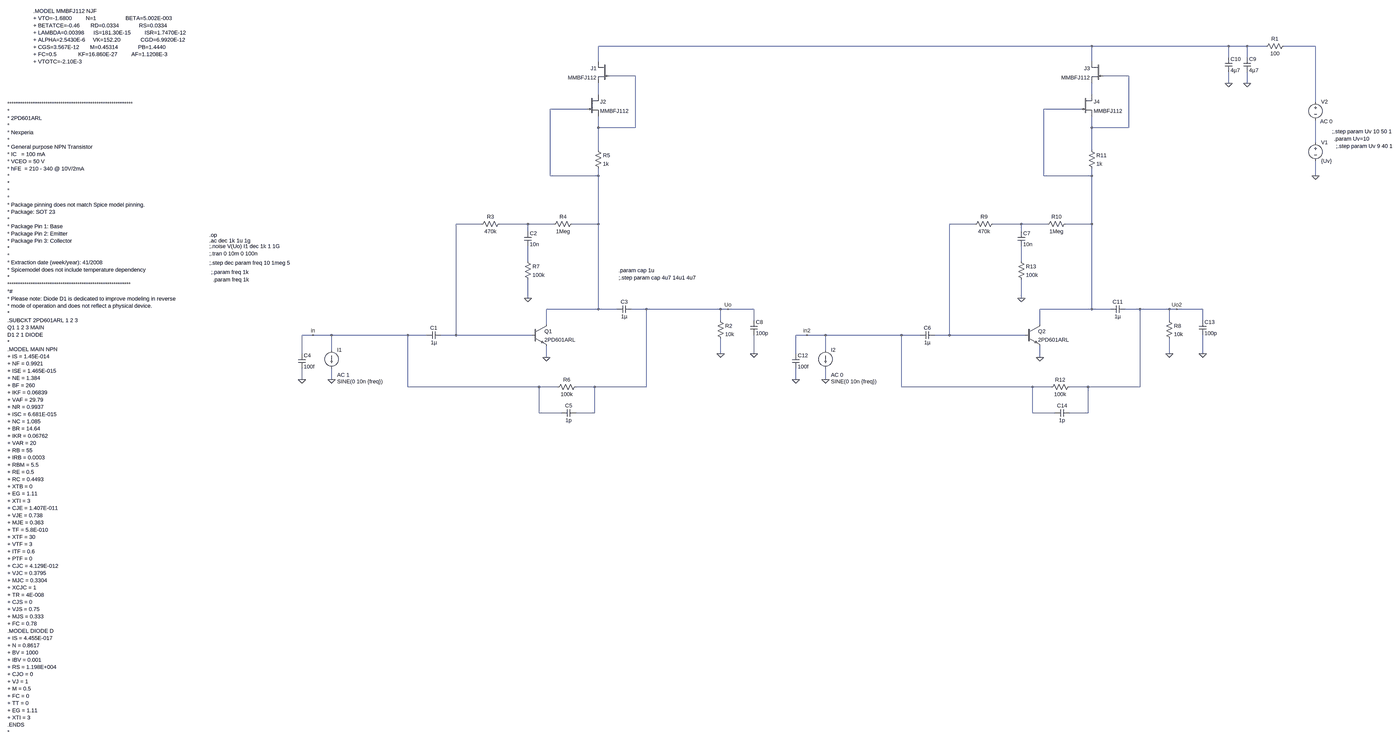
[diagram p0: schematic v2.0.crosstalk.asc, whole sheet]
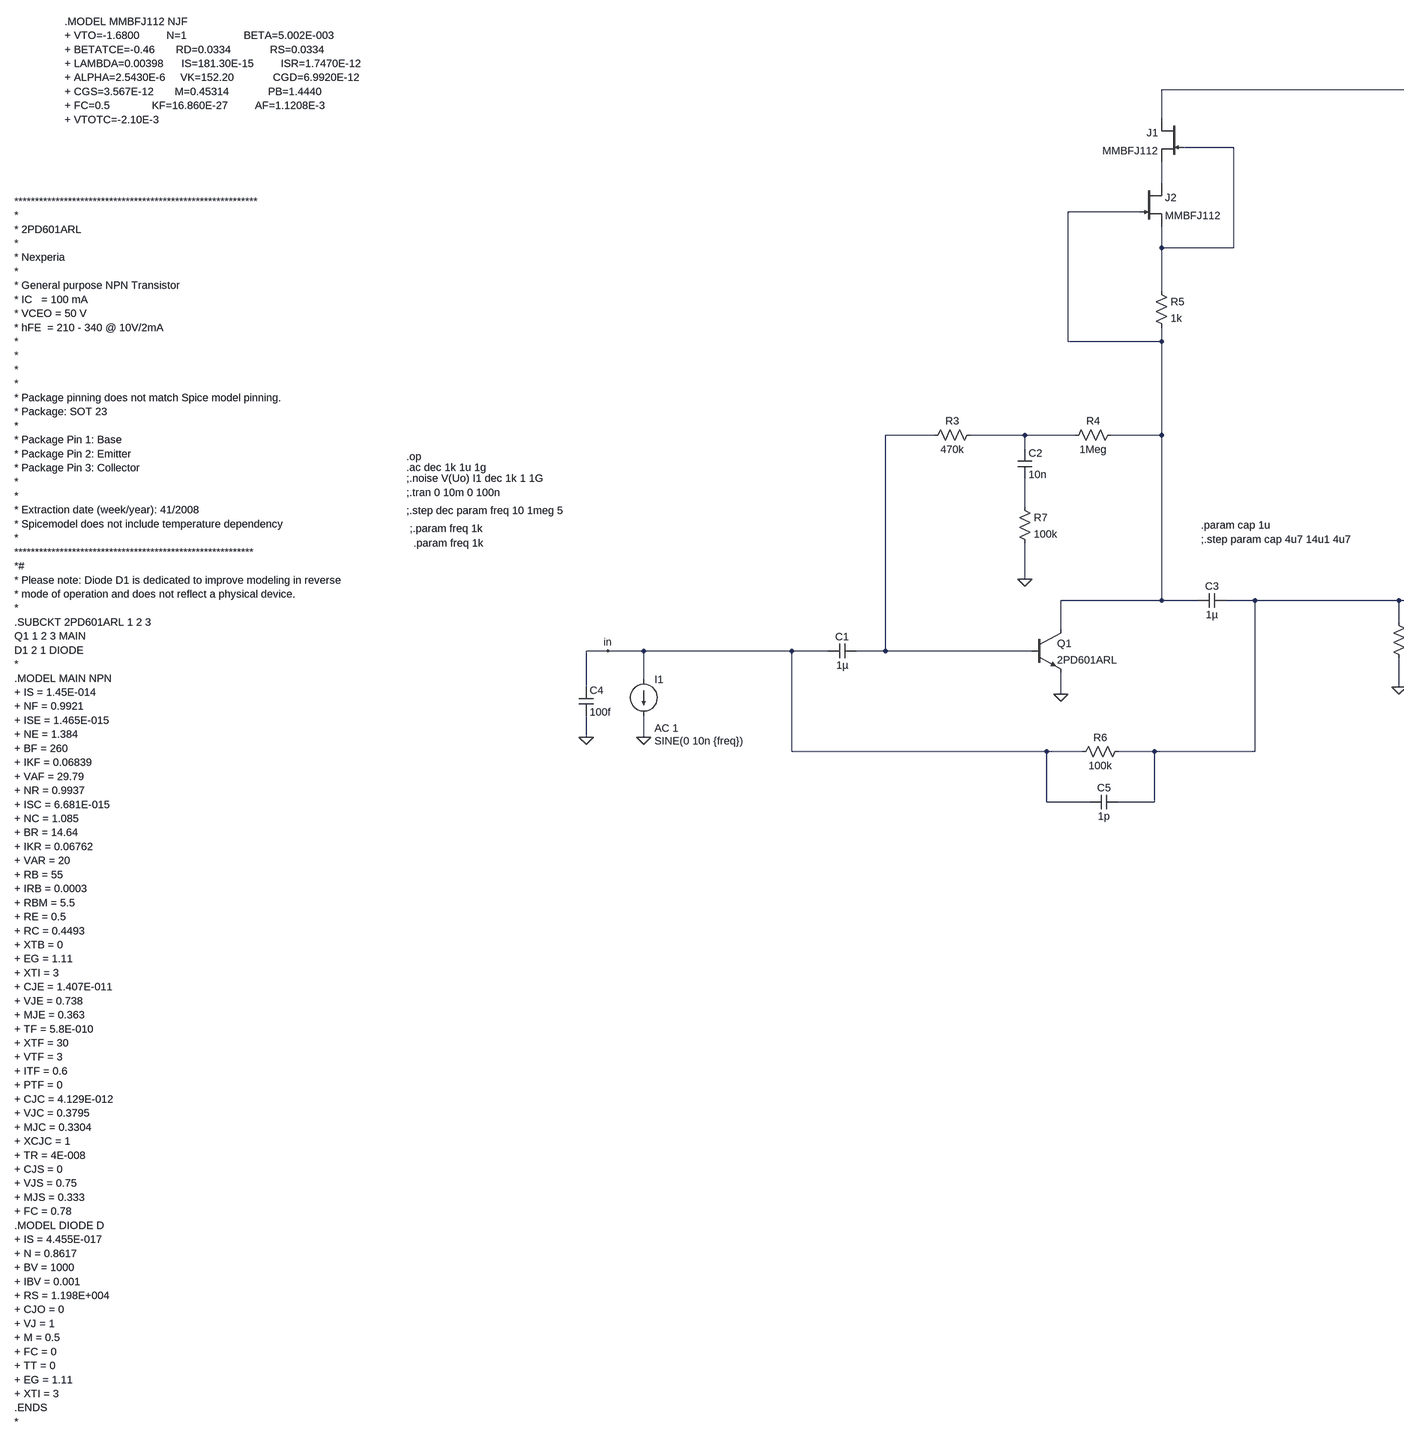
[diagram p1: schematic v2.0.crosstalk.asc, part, row 1 of 1, column 1 of 2]
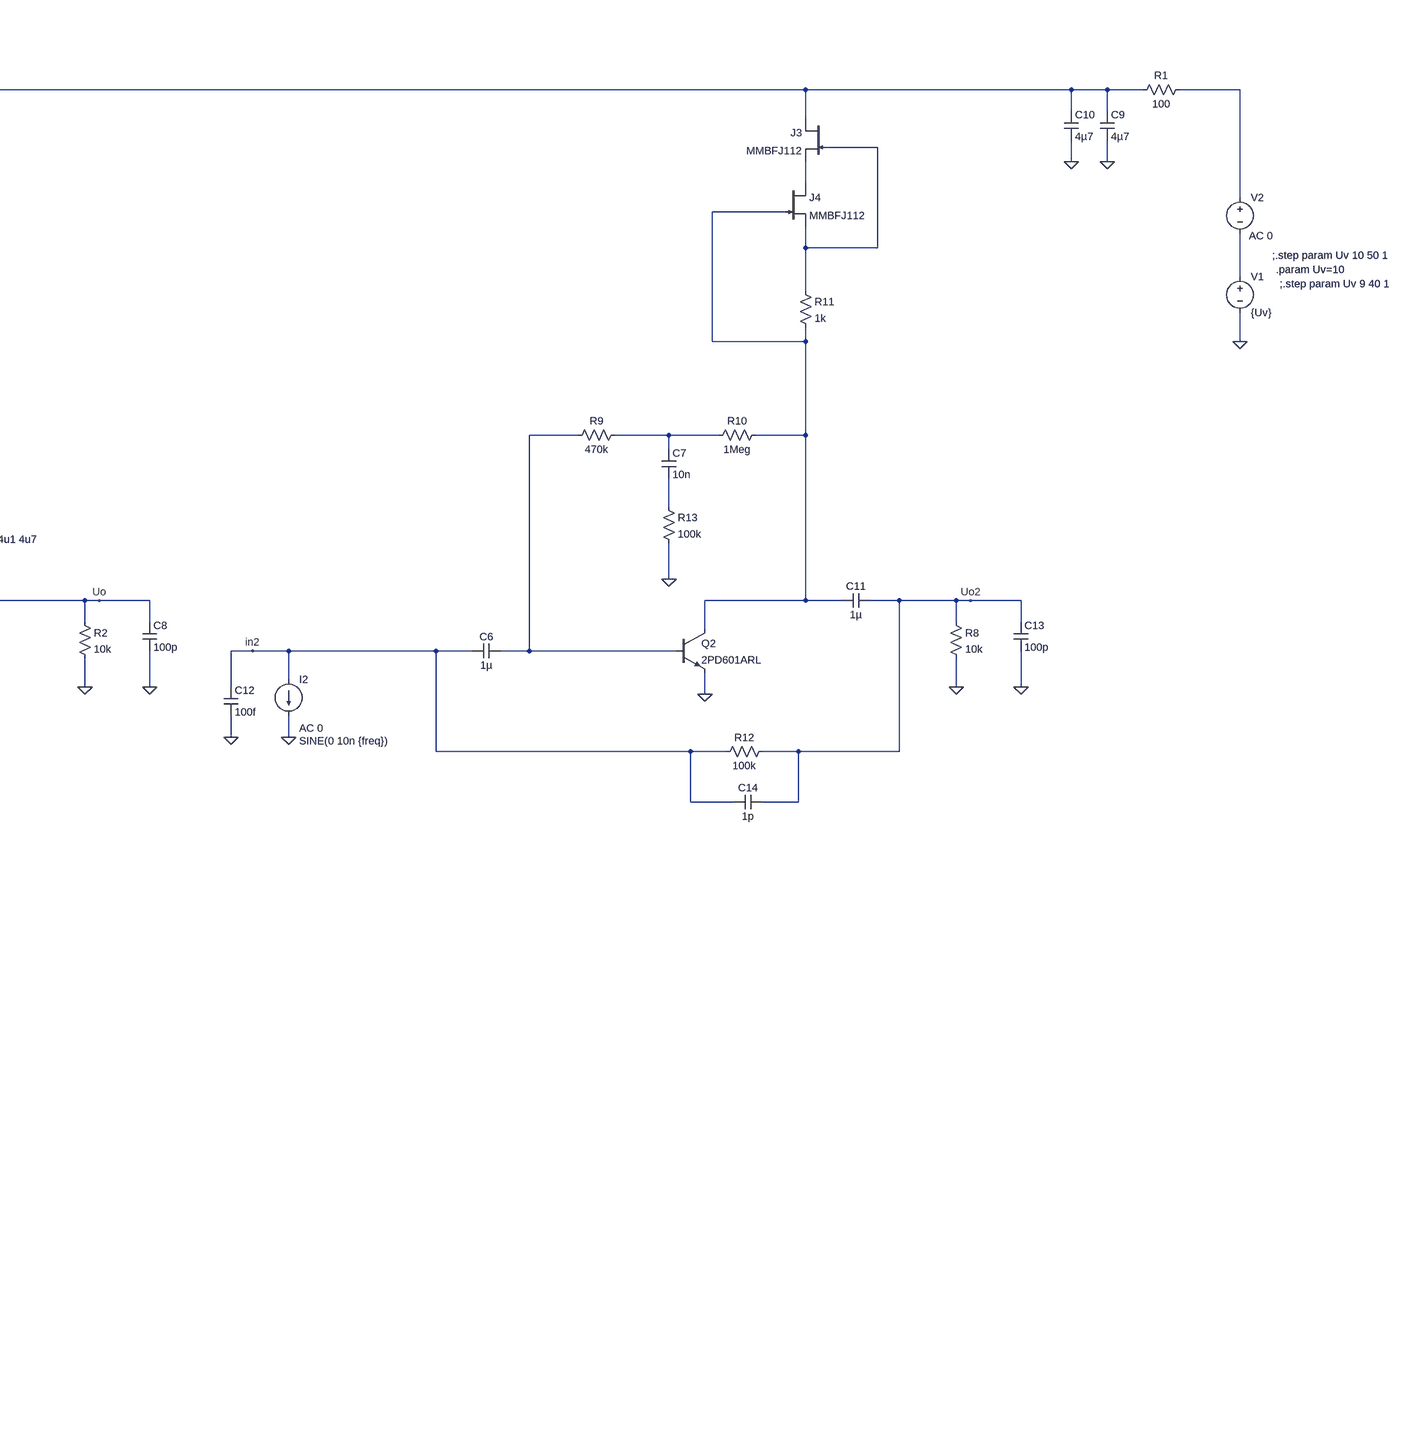
[diagram p2: schematic v2.0.crosstalk.asc, part, row 1 of 1, column 2 of 2]
v2.0.crosstalk.asc, the LTspice schematic file:
Version 4
SHEET 1 4916 2076
WIRE 3296 -816 624 -816
WIRE 4080 -816 3296 -816
WIRE 4160 -816 4080 -816
WIRE 4240 -816 4160 -816
WIRE 4560 -816 4320 -816
WIRE 4080 -768 4080 -816
WIRE 4160 -768 4160 -816
WIRE 624 -752 624 -816
WIRE 3296 -752 3296 -816
WIRE 784 -688 672 -688
WIRE 3456 -688 3344 -688
WIRE 4080 -656 4080 -704
WIRE 4160 -656 4160 -704
WIRE 624 -608 624 -656
WIRE 3296 -608 3296 -656
WIRE 4560 -576 4560 -816
WIRE 576 -544 416 -544
WIRE 3248 -544 3088 -544
WIRE 624 -464 624 -512
WIRE 784 -464 784 -688
WIRE 784 -464 624 -464
WIRE 3296 -464 3296 -512
WIRE 3456 -464 3456 -688
WIRE 3456 -464 3296 -464
WIRE 4560 -400 4560 -496
WIRE 624 -368 624 -464
WIRE 3296 -368 3296 -464
WIRE 416 -256 416 -544
WIRE 624 -256 624 -288
WIRE 624 -256 416 -256
WIRE 3088 -256 3088 -544
WIRE 3296 -256 3296 -288
WIRE 3296 -256 3088 -256
WIRE 4560 -256 4560 -320
WIRE -16 -48 -160 -48
WIRE 320 -48 64 -48
WIRE 432 -48 320 -48
WIRE 624 -48 624 -256
WIRE 624 -48 512 -48
WIRE 2656 -48 2512 -48
WIRE 2992 -48 2736 -48
WIRE 3104 -48 2992 -48
WIRE 3296 -48 3296 -256
WIRE 3296 -48 3184 -48
WIRE 320 -16 320 -48
WIRE 2992 -16 2992 -48
WIRE 320 112 320 48
WIRE 2992 112 2992 48
WIRE 320 272 320 192
WIRE 2992 272 2992 192
WIRE 624 320 624 -48
WIRE 624 320 400 320
WIRE 704 320 624 320
WIRE 832 320 768 320
WIRE 1152 320 832 320
WIRE 1184 320 1152 320
WIRE 1296 320 1184 320
WIRE 3296 320 3296 -48
WIRE 3296 320 3072 320
WIRE 3376 320 3296 320
WIRE 3504 320 3440 320
WIRE 3824 320 3504 320
WIRE 3856 320 3824 320
WIRE 3968 320 3856 320
WIRE 1152 368 1152 320
WIRE 1296 368 1296 320
WIRE 3824 368 3824 320
WIRE 3968 368 3968 320
WIRE 400 384 400 320
WIRE 3072 384 3072 320
WIRE -1104 432 -1152 432
WIRE -1024 432 -1104 432
WIRE -368 432 -1024 432
WIRE -288 432 -368 432
WIRE -160 432 -160 -48
WIRE -160 432 -224 432
WIRE 336 432 -160 432
WIRE 1568 432 1520 432
WIRE 1648 432 1568 432
WIRE 2304 432 1648 432
WIRE 2384 432 2304 432
WIRE 2512 432 2512 -48
WIRE 2512 432 2448 432
WIRE 3008 432 2512 432
WIRE -1024 496 -1024 432
WIRE 1648 496 1648 432
WIRE -1152 512 -1152 432
WIRE 1152 512 1152 448
WIRE 1296 512 1296 432
WIRE 1520 512 1520 432
WIRE 3824 512 3824 448
WIRE 3968 512 3968 432
WIRE 400 528 400 480
WIRE 3072 528 3072 480
WIRE -1152 624 -1152 576
WIRE -1024 624 -1024 576
WIRE 1520 624 1520 576
WIRE 1648 624 1648 576
WIRE -368 656 -368 432
WIRE 368 656 -368 656
WIRE 448 656 368 656
WIRE 608 656 528 656
WIRE 832 656 832 320
WIRE 832 656 608 656
WIRE 2304 656 2304 432
WIRE 3040 656 2304 656
WIRE 3120 656 3040 656
WIRE 3280 656 3200 656
WIRE 3504 656 3504 320
WIRE 3504 656 3280 656
WIRE 368 768 368 656
WIRE 464 768 368 768
WIRE 608 768 608 656
WIRE 608 768 528 768
WIRE 3040 768 3040 656
WIRE 3136 768 3040 768
WIRE 3280 768 3280 656
WIRE 3280 768 3200 768
FLAG 400 528 0
FLAG 1152 512 0
FLAG 1184 320 Uo
FLAG 320 272 0
FLAG 4560 -256 0
FLAG -1024 624 0
FLAG -1152 624 0
FLAG 1296 512 0
FLAG 4080 -656 0
FLAG 4160 -656 0
FLAG -1104 432 in
FLAG 3072 528 0
FLAG 3824 512 0
FLAG 3856 320 Uo2
FLAG 2992 272 0
FLAG 1648 624 0
FLAG 1520 624 0
FLAG 3968 512 0
FLAG 1568 432 in2
DATAFLAG 224 432 ""
DATAFLAG 480 320 ""
DATAFLAG 912 320 ""
DATAFLAG 704 -816 "$-V(N003)"
DATAFLAG 480 -544 "$-V(N003)"
DATAFLAG 2896 432 ""
DATAFLAG 3152 320 ""
DATAFLAG 3584 320 ""
DATAFLAG 3376 -816 "$-V(N003)"
DATAFLAG 3152 -544 "$-V(N003)"
SYMBOL res 1136 352 R0
SYMATTR InstName R2
SYMATTR Value 10k
SYMBOL cap -224 416 R90
WINDOW 0 0 32 VBottom 2
WINDOW 3 32 32 VTop 2
SYMATTR InstName C1
SYMATTR Value 1µ
SYMBOL res 80 -64 R90
WINDOW 0 0 56 VBottom 2
WINDOW 3 32 56 VTop 2
SYMATTR InstName R3
SYMATTR Value 470k
SYMBOL res 528 -64 R90
WINDOW 0 0 56 VBottom 2
WINDOW 3 32 56 VTop 2
SYMATTR InstName R4
SYMATTR Value 1Meg
SYMBOL cap 304 -16 R0
SYMATTR InstName C2
SYMATTR Value 10n
SYMBOL cap 768 304 R90
WINDOW 0 0 32 VBottom 2
WINDOW 3 32 32 VTop 2
SYMATTR InstName C3
SYMATTR Value 1µ
SYMBOL njf 672 -752 M0
SYMATTR InstName J1
SYMATTR Value MMBFJ112
SYMBOL res 608 -384 R0
SYMATTR InstName R5
SYMATTR Value 1k
SYMBOL voltage 4560 -416 R0
WINDOW 123 0 0 Left 0
WINDOW 39 0 0 Left 0
SYMATTR InstName V1
SYMATTR Value {Uv}
SYMBOL current -1024 496 R0
WINDOW 3 24 136 Left 2
WINDOW 123 24 108 Left 2
WINDOW 39 0 0 Left 0
SYMATTR Value SINE(0 10n {freq})
SYMATTR Value2 AC 1
SYMATTR InstName I1
SYMBOL cap -1168 512 R0
SYMATTR InstName C4
SYMATTR Value 100f
SYMBOL res 544 640 R90
WINDOW 0 0 56 VBottom 2
WINDOW 3 32 56 VTop 2
SYMATTR InstName R6
SYMATTR Value 100k
SYMBOL cap 1280 368 R0
SYMATTR InstName C8
SYMATTR Value 100p
SYMBOL res 4336 -832 R90
WINDOW 0 0 56 VBottom 2
WINDOW 3 32 56 VTop 2
SYMATTR InstName R1
SYMATTR Value 100
SYMBOL cap 4144 -768 R0
SYMATTR InstName C9
SYMATTR Value 4µ7
SYMBOL cap 4064 -768 R0
SYMATTR InstName C10
SYMATTR Value 4µ7
SYMBOL voltage 4560 -592 R0
WINDOW 3 24 96 Invisible 2
WINDOW 123 20 101 Left 2
WINDOW 39 0 0 Left 0
SYMATTR Value 0
SYMATTR Value2 AC 0
SYMATTR InstName V2
SYMBOL njf 576 -608 R0
SYMATTR InstName J2
SYMATTR Value MMBFJ112
SYMBOL npn 336 384 R0
SYMATTR InstName Q1
SYMATTR Value 2PD601ARL
SYMATTR Prefix X
SYMBOL cap 528 752 R90
WINDOW 0 0 32 VBottom 2
WINDOW 3 32 32 VTop 2
SYMATTR InstName C5
SYMATTR Value 1p
SYMBOL res 304 96 R0
SYMATTR InstName R7
SYMATTR Value 100k
SYMBOL res 3808 352 R0
SYMATTR InstName R8
SYMATTR Value 10k
SYMBOL cap 2448 416 R90
WINDOW 0 0 32 VBottom 2
WINDOW 3 32 32 VTop 2
SYMATTR InstName C6
SYMATTR Value 1µ
SYMBOL res 2752 -64 R90
WINDOW 0 0 56 VBottom 2
WINDOW 3 32 56 VTop 2
SYMATTR InstName R9
SYMATTR Value 470k
SYMBOL res 3200 -64 R90
WINDOW 0 0 56 VBottom 2
WINDOW 3 32 56 VTop 2
SYMATTR InstName R10
SYMATTR Value 1Meg
SYMBOL cap 2976 -16 R0
SYMATTR InstName C7
SYMATTR Value 10n
SYMBOL cap 3440 304 R90
WINDOW 0 0 32 VBottom 2
WINDOW 3 32 32 VTop 2
SYMATTR InstName C11
SYMATTR Value 1µ
SYMBOL njf 3344 -752 M0
SYMATTR InstName J3
SYMATTR Value MMBFJ112
SYMBOL res 3280 -384 R0
SYMATTR InstName R11
SYMATTR Value 1k
SYMBOL current 1648 496 R0
WINDOW 3 24 136 Left 2
WINDOW 123 24 108 Left 2
WINDOW 39 0 0 Left 0
SYMATTR Value SINE(0 10n {freq})
SYMATTR Value2 AC 0
SYMATTR InstName I2
SYMBOL cap 1504 512 R0
SYMATTR InstName C12
SYMATTR Value 100f
SYMBOL res 3216 640 R90
WINDOW 0 0 56 VBottom 2
WINDOW 3 32 56 VTop 2
SYMATTR InstName R12
SYMATTR Value 100k
SYMBOL cap 3952 368 R0
SYMATTR InstName C13
SYMATTR Value 100p
SYMBOL njf 3248 -608 R0
SYMATTR InstName J4
SYMATTR Value MMBFJ112
SYMBOL npn 3008 384 R0
SYMATTR InstName Q2
SYMATTR Value 2PD601ARL
SYMATTR Prefix X
SYMBOL cap 3200 752 R90
WINDOW 0 0 32 VBottom 2
WINDOW 3 32 32 VTop 2
SYMATTR InstName C14
SYMATTR Value 1p
SYMBOL res 2976 96 R0
SYMATTR InstName R13
SYMATTR Value 100k
TEXT -1552 0 Left 2 !.op
TEXT -1552 24 Left 2 !.ac dec 1k 1u 1g
TEXT 4632 -448 Left 2 !;.step param Uv 10 50 1
TEXT 4640 -416 Left 2 !.param Uv=10
TEXT -1552 48 Left 2 !;.noise V(Uo) I1 dec 1k 1 1G
TEXT -2768 -968 Left 2 !.MODEL MMBFJ112 NJF\n+ VTO=-1.6800         N=1                   BETA=5.002E-003\n+ BETATCE=-0.46       RD=0.0334             RS=0.0334                  \n+ LAMBDA=0.00398      IS=181.30E-15         ISR=1.7470E-12\n+ ALPHA=2.5430E-6     VK=152.20             CGD=6.9920E-12          \n+ CGS=3.567E-12       M=0.45314             PB=1.4440  \n+ FC=0.5              KF=16.860E-27         AF=1.1208E-3        \n+ VTOTC=-2.10E-3
TEXT -2880 -568 Left 2 !***********************************************************\n*\n* 2PD601ARL\n*\n* Nexperia\n*\n* General purpose NPN Transistor\n* IC   = 100 mA\n* VCEO = 50 V \n* hFE  = 210 - 340 @ 10V/2mA\n*\n*\n*\n*\n* Package pinning does not match Spice model pinning.\n* Package: SOT 23\n* \n* Package Pin 1: Base\n* Package Pin 2: Emitter\n* Package Pin 3: Collector\n*\n*\n* Extraction date (week/year): 41/2008  \n* Spicemodel does not include temperature dependency\n*\n**********************************************************\n*#\n* Please note: Diode D1 is dedicated to improve modeling in reverse\n* mode of operation and does not reflect a physical device.\n*\n.SUBCKT 2PD601ARL 1 2 3\nQ1 1 2 3 MAIN\nD1 2 1 DIODE\n*\n.MODEL MAIN NPN \n+ IS = 1.45E-014 \n+ NF = 0.9921 \n+ ISE = 1.465E-015 \n+ NE = 1.384 \n+ BF = 260 \n+ IKF = 0.06839 \n+ VAF = 29.79 \n+ NR = 0.9937 \n+ ISC = 6.681E-015 \n+ NC = 1.085 \n+ BR = 14.64 \n+ IKR = 0.06762 \n+ VAR = 20 \n+ RB = 55 \n+ IRB = 0.0003 \n+ RBM = 5.5 \n+ RE = 0.5 \n+ RC = 0.4493 \n+ XTB = 0 \n+ EG = 1.11 \n+ XTI = 3 \n+ CJE = 1.407E-011 \n+ VJE = 0.738 \n+ MJE = 0.363 \n+ TF = 5.8E-010 \n+ XTF = 30 \n+ VTF = 3 \n+ ITF = 0.6 \n+ PTF = 0 \n+ CJC = 4.129E-012 \n+ VJC = 0.3795 \n+ MJC = 0.3304 \n+ XCJC = 1 \n+ TR = 4E-008 \n+ CJS = 0 \n+ VJS = 0.75 \n+ MJS = 0.333 \n+ FC = 0.78 \n.MODEL DIODE D \n+ IS = 4.455E-017 \n+ N = 0.8617 \n+ BV = 1000 \n+ IBV = 0.001 \n+ RS = 1.198E+004 \n+ CJO = 0 \n+ VJ = 1 \n+ M = 0.5 \n+ FC = 0 \n+ TT = 0 \n+ EG = 1.11 \n+ XTI = 3 \n.ENDS\n*
TEXT -1552 80 Left 2 !;.tran 0 10m 0 100n
TEXT -1552 120 Left 2 !;.step dec param freq 10 1meg 5
TEXT -1544 160 Left 2 !;.param freq 1k
TEXT 712 184 Left 2 !;.step param cap 4u7 14u1 4u7
TEXT -1536 192 Left 2 !.param freq 1k
TEXT 712 152 Left 2 !.param cap 1u
TEXT 4648 -384 Left 2 !;.step param Uv 9 40 1

The netlist it stands for:
* v2.0.crosstalk.asc
R2 Uo 0 10k
C1 N010 in 1µ
R3 N011 N010 470k
R4 N007 N011 1Meg
C2 N011 N014 10n
C3 Uo N007 1µ
J1 N001 N003 N005 MMBFJ112
R5 N003 N007 1k
V1 N009 0 {Uv}
I1 in 0 SINE(0 10n {freq}) AC 1
C4 in 0 100f
R6 Uo in 100k
C8 Uo 0 100p
R1 N002 N001 100
C9 N001 0 4µ7
C10 N001 0 4µ7
V2 N002 N009 0 AC 0
J2 N005 N007 N003 MMBFJ112
XQ1 N007 N010 0 2PD601ARL  ; pins C B E
C5 Uo in 1p
R7 N014 0 100k
R8 Uo2 0 10k
C6 N012 in2 1µ
R9 N013 N012 470k
R10 N008 N013 1Meg
C7 N013 N015 10n
C11 Uo2 N008 1µ
J3 N001 N004 N006 MMBFJ112
R11 N004 N008 1k
I2 in2 0 SINE(0 10n {freq}) AC 0
C12 in2 0 100f
R12 Uo2 in2 100k
C13 Uo2 0 100p
J4 N006 N008 N004 MMBFJ112
XQ2 N008 N012 0 2PD601ARL  ; pins C B E
C14 Uo2 in2 1p
R13 N015 0 100k
.model NJF NJF
.model PJF PJF
.lib standard.jft
.op
.ac dec 1k 1u 1g
;.step param Uv 10 50 1
.param Uv=10
;.noise V(Uo) I1 dec 1k 1 1G
.MODEL MMBFJ112 NJF
+ VTO=-1.6800         N=1                   BETA=5.002E-003
+ BETATCE=-0.46       RD=0.0334             RS=0.0334
+ LAMBDA=0.00398      IS=181.30E-15         ISR=1.7470E-12
+ ALPHA=2.5430E-6     VK=152.20             CGD=6.9920E-12
+ CGS=3.567E-12       M=0.45314             PB=1.4440
+ FC=0.5              KF=16.860E-27         AF=1.1208E-3
+ VTOTC=-2.10E-3
***********************************************************
*
* 2PD601ARL
*
* Nexperia
*
* General purpose NPN Transistor
* IC   = 100 mA
* VCEO = 50 V
* hFE  = 210 - 340 @ 10V/2mA
*
*
*
*
* Package pinning does not match Spice model pinning.
* Package: SOT 23
*
* Package Pin 1: Base
* Package Pin 2: Emitter
* Package Pin 3: Collector
*
*
* Extraction date (week/year): 41/2008
* Spicemodel does not include temperature dependency
*
**********************************************************
*#
* Please note: Diode D1 is dedicated to improve modeling in reverse
* mode of operation and does not reflect a physical device.
*
.SUBCKT 2PD601ARL 1 2 3
Q1 1 2 3 MAIN
D1 2 1 DIODE
*
.MODEL MAIN NPN
+ IS = 1.45E-014
+ NF = 0.9921
+ ISE = 1.465E-015
+ NE = 1.384
+ BF = 260
+ IKF = 0.06839
+ VAF = 29.79
+ NR = 0.9937
+ ISC = 6.681E-015
+ NC = 1.085
+ BR = 14.64
+ IKR = 0.06762
+ VAR = 20
+ RB = 55
+ IRB = 0.0003
+ RBM = 5.5
+ RE = 0.5
+ RC = 0.4493
+ XTB = 0
+ EG = 1.11
+ XTI = 3
+ CJE = 1.407E-011
+ VJE = 0.738
+ MJE = 0.363
+ TF = 5.8E-010
+ XTF = 30
+ VTF = 3
+ ITF = 0.6
+ PTF = 0
+ CJC = 4.129E-012
+ VJC = 0.3795
+ MJC = 0.3304
+ XCJC = 1
+ TR = 4E-008
+ CJS = 0
+ VJS = 0.75
+ MJS = 0.333
+ FC = 0.78
.MODEL DIODE D
+ IS = 4.455E-017
+ N = 0.8617
+ BV = 1000
+ IBV = 0.001
+ RS = 1.198E+004
+ CJO = 0
+ VJ = 1
+ M = 0.5
+ FC = 0
+ TT = 0
+ EG = 1.11
+ XTI = 3
.ENDS
*
;.tran 0 10m 0 100n
;.step dec param freq 10 1meg 5
;.param freq 1k
;.step param cap 4u7 14u1 4u7
.param freq 1k
.param cap 1u
;.step param Uv 9 40 1
.backanno
.end